# EAGLE schematic SAME54-Dev (EAGLE 9.3.0)

## Sheet 1 of 5: MCU
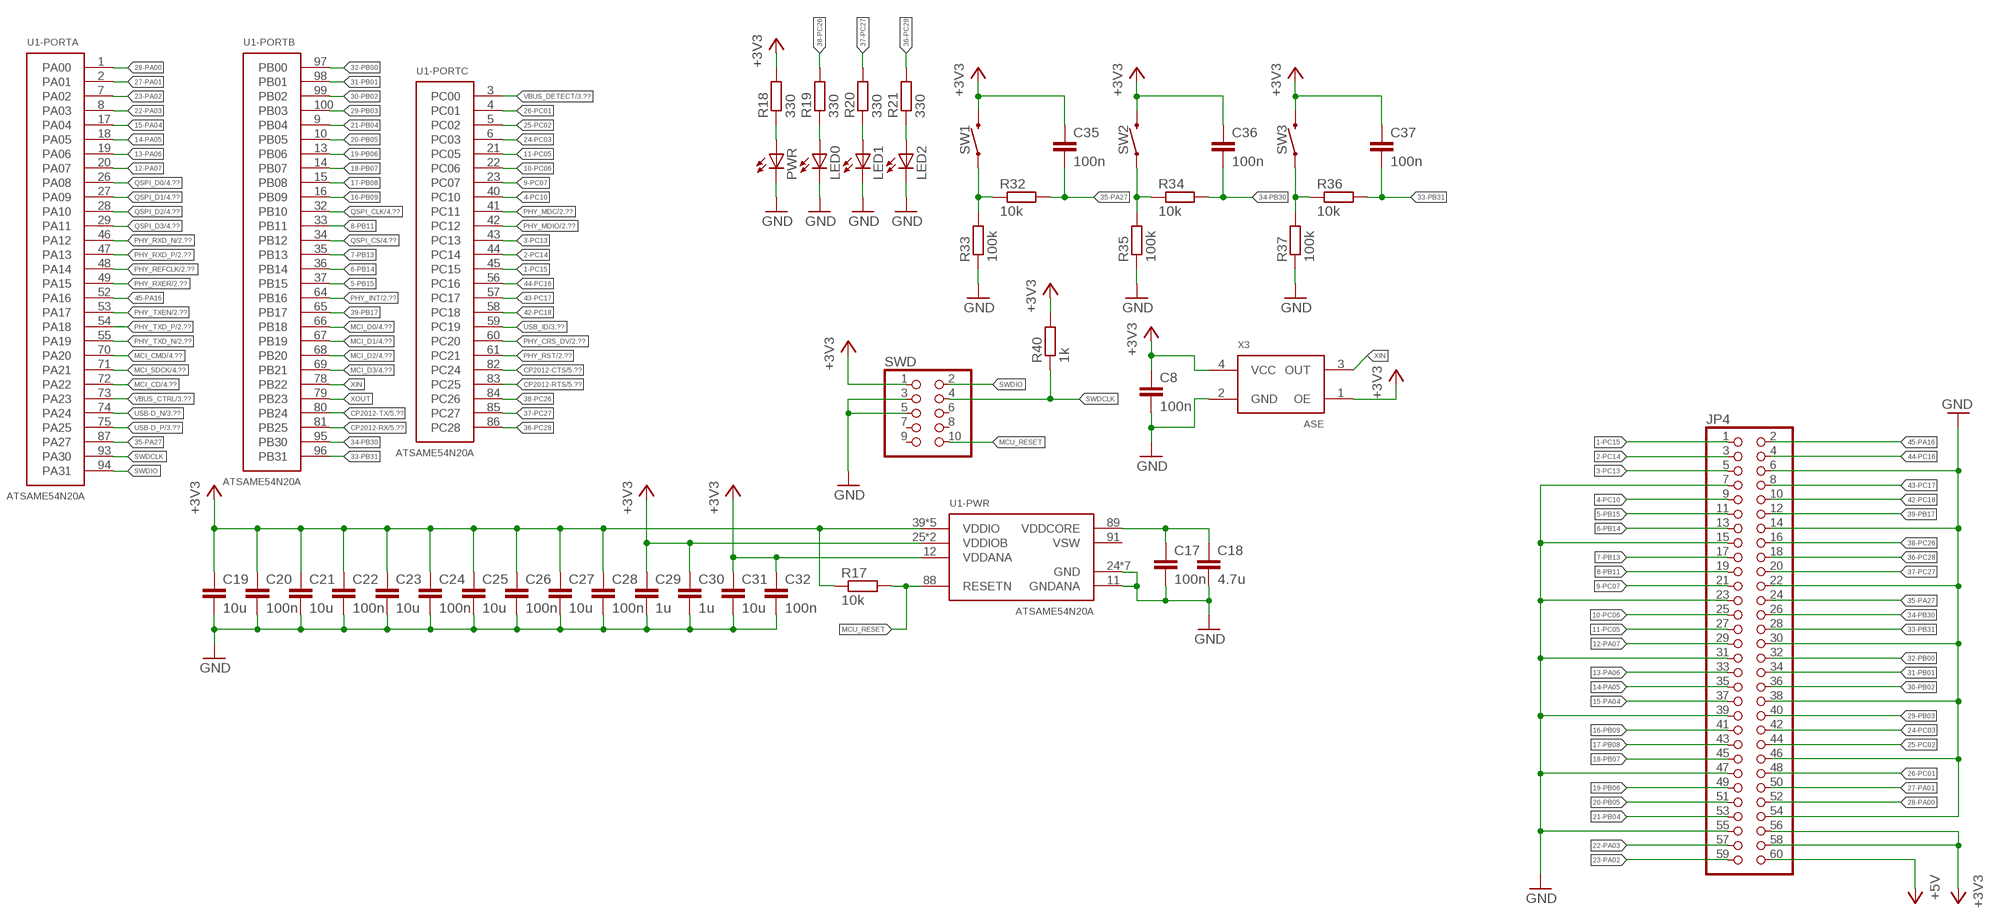
[diagram p0: schematic, sheet 1]

### Parts
C8  100n  C-EUC0603  [C0603]
C17  100n  C-EUC0603  [C0603]
C18  4.7u  C-EUC0805  [C0805]
C19  10u  C-EUC0805  [C0805]
C20  100n  C-EUC0603  [C0603]
C21  10u  C-EUC0805  [C0805]
C22  100n  C-EUC0603  [C0603]
C23  10u  C-EUC0805  [C0805]
C24  100n  C-EUC0603  [C0603]
C25  10u  C-EUC0805  [C0805]
C26  100n  C-EUC0603  [C0603]
C27  10u  C-EUC0805  [C0805]
C28  100n  C-EUC0603  [C0603]
C29  1u  C-EUC0805  [C0805]
C30  1u  C-EUC0805  [C0805]
C31  10u  C-EUC0805  [C0805]
C32  100n  C-EUC0603  [C0603]
C35  100n  C-EUC0603  [C0603]
C36  100n  C-EUC0603  [C0603]
C37  100n  C-EUC0603  [C0603]
JP4  PINHD-2X30  [2X30]
LED0  LEDCHIPLED_0603  [CHIPLED_0603]
LED1  LEDCHIPLED_0603  [CHIPLED_0603]
LED2  LEDCHIPLED_0603  [CHIPLED_0603]
PWR  LEDCHIPLED_0603  [CHIPLED_0603]
R17  10k  R-EU_R0603  [R0603]
R18  330  R-EU_R0603  [R0603]
R19  330  R-EU_R0603  [R0603]
R20  330  R-EU_R0603  [R0603]
R21  330  R-EU_R0603  [R0603]
R32  10k  R-EU_R0603  [R0603]
R33  100k  R-EU_R0603  [R0603]
R34  10k  R-EU_R0603  [R0603]
R35  100k  R-EU_R0603  [R0603]
R36  10k  R-EU_R0603  [R0603]
R37  100k  R-EU_R0603  [R0603]
R40  1k  R-EU_R0603  [R0603]
SW1  MOMENTARY-SWITCH-SPST-SMD-6.2MM-TALL  [TACTILE_SWITCH_SMD_6.2MM_TALL]
SW2  MOMENTARY-SWITCH-SPST-SMD-6.2MM-TALL  [TACTILE_SWITCH_SMD_6.2MM_TALL]
SW3  MOMENTARY-SWITCH-SPST-SMD-6.2MM-TALL  [TACTILE_SWITCH_SMD_6.2MM_TALL]
SWD  PINHD-2X5  [2X05]
U1  ATSAME54N20A  [TQFP100]
X3  ASE  [ASE]

### Nets
1-PC15: JP4.1 U1.45(-PORTC:PC15)
2-PC14: JP4.3 U1.44(-PORTC:PC14)
3-PC13: JP4.5 U1.43(-PORTC:PC13)
4-PC10: JP4.9 U1.40(-PORTC:PC10)
5-PB15: JP4.11 U1.37(-PORTB:PB15)
6-PB14: JP4.13 U1.36(-PORTB:PB14)
7-PB13: JP4.17 U1.35(-PORTB:PB13)
8-PB11: JP4.19 U1.33(-PORTB:PB11)
9-PC07: JP4.21 U1.23(-PORTC:PC07)
10-PC06: JP4.25 U1.22(-PORTC:PC06)
11-PC05: JP4.27 U1.21(-PORTC:PC05)
12-PA07: JP4.29 U1.20(-PORTA:PA07)
13-PA06: JP4.33 U1.19(-PORTA:PA06)
14-PA05: JP4.35 U1.18(-PORTA:PA05)
15-PA04: JP4.37 U1.17(-PORTA:PA04)
16-PB09: JP4.41 U1.16(-PORTB:PB09)
17-PB08: JP4.43 U1.15(-PORTB:PB08)
18-PB07: JP4.45 U1.14(-PORTB:PB07)
19-PB06: JP4.49 U1.13(-PORTB:PB06)
20-PB05: JP4.51 U1.10(-PORTB:PB05)
21-PB04: JP4.53 U1.9(-PORTB:PB04)
22-PA03: JP4.57 U1.8(-PORTA:PA03)
23-PA02: JP4.59 U1.7(-PORTA:PA02)
24-PC03: JP4.42 U1.6(-PORTC:PC03)
25-PC02: JP4.44 U1.5(-PORTC:PC02)
26-PC01: JP4.48 U1.4(-PORTC:PC01)
27-PA01: JP4.50 U1.2(-PORTA:PA01)
28-PA00: JP4.52 U1.1(-PORTA:PA00)
29-PB03: JP4.40 U1.100(-PORTB:PB03)
30-PB02: JP4.36 U1.99(-PORTB:PB02)
31-PB01: JP4.34 U1.98(-PORTB:PB01)
32-PB00: JP4.32 U1.97(-PORTB:PB00)
33-PB31: C37.2 JP4.28 R36.2 U1.96(-PORTB:PB31)
34-PB30: C36.2 JP4.26 R34.2 U1.95(-PORTB:PB30)
35-PA27: C35.2 JP4.24 R32.2 U1.87(-PORTA:PA27)
36-PC28: JP4.18 R21.2 U1.86(-PORTC:PC28)
37-PC27: JP4.20 R20.2 U1.85(-PORTC:PC27)
38-PC26: JP4.16 R19.2 U1.84(-PORTC:PC26)
39-PB17: JP4.12 U1.65(-PORTB:PB17)
42-PC18: JP4.10 U1.58(-PORTC:PC18)
43-PC17: JP4.8 U1.57(-PORTC:PC17)
44-PC16: JP4.4 U1.56(-PORTC:PC16)
45-PA16: JP4.2 U1.52(-PORTA:PA16)
+3V3: C8.1 C19.1 C20.1 C21.1 C22.1 C23.1 C24.1 C25.1 C26.1 C27.1 C28.1 C29.1 C30.1 C31.1 C32.1 C35.1 C36.1 C37.1 JP4.56 JP4.58 R17.1 R18.2 R40.2 SW1.B2 SW2.B2 SW3.B2 SWD.1 U1.12(-PWR:VDDANA) U1.25(-PWR:VDDIOB) U1.30(-PWR:VDDIOB) U1.39(-PWR:VDDIO) U1.51(-PWR:VDDIO) U1.63(-PWR:VDDIO) U1.77(-PWR:VDDIO) U1.92(-PWR:VDDIO) X3.1(OE) X3.4(VCC) ; also sheet 2,4,5
+5V: JP4.60 ; also sheet 3,5
CP2012-CTS: U1.82(-PORTC:PC24) ; also sheet 5
CP2012-RTS: U1.83(-PORTC:PC25) ; also sheet 5
CP2012-RX: U1.81(-PORTB:PB25) ; also sheet 5
CP2012-TX: U1.80(-PORTB:PB24) ; also sheet 5
GND: C8.2 C17.2 C18.2 C19.2 C20.2 C21.2 C22.2 C23.2 C24.2 C25.2 C26.2 C27.2 C28.2 C29.2 C30.2 C31.2 C32.2 JP4.6 JP4.7 JP4.14 JP4.15 JP4.22 JP4.23 JP4.30 JP4.31 JP4.38 JP4.39 JP4.46 JP4.47 JP4.54 JP4.55 LED0.C LED1.C LED2.C PWR.C R33.1 R35.1 R37.1 SWD.3 SWD.5 U1.11(-PWR:GNDANA) U1.24(-PWR:GND) U1.31(-PWR:GND) U1.38(-PWR:GND) U1.50(-PWR:GND) U1.62(-PWR:GND) U1.76(-PWR:GND) U1.90(-PWR:GND) X3.2(GND) ; also sheet 2,3,4,5
MCI_CD: U1.72(-PORTA:PA22) ; also sheet 4
MCI_CMD: U1.70(-PORTA:PA20) ; also sheet 4
MCI_D0: U1.66(-PORTB:PB18) ; also sheet 4
MCI_D1: U1.67(-PORTB:PB19) ; also sheet 4
MCI_D2: U1.68(-PORTB:PB20) ; also sheet 4
MCI_D3: U1.69(-PORTB:PB21) ; also sheet 4
MCI_SDCK: U1.71(-PORTA:PA21) ; also sheet 4
MCU_RESET: R17.2 SWD.10 U1.88(-PWR:RESETN)
N$9: PWR.A R18.1
N$14: LED0.A R19.1
N$17: C17.1 C18.1 U1.89(-PWR:VDDCORE)
N$18: LED1.A R20.1
N$19: LED2.A R21.1
N$21: R32.1 R33.2 SW1.A2
N$22: R34.1 R35.2 SW2.A2
N$23: R36.1 R37.2 SW3.A2
PHY_CRS_DV: U1.60(-PORTC:PC20) ; also sheet 2
PHY_INT: U1.64(-PORTB:PB16) ; also sheet 2
PHY_MDC: U1.41(-PORTC:PC11) ; also sheet 2
PHY_MDIO: U1.42(-PORTC:PC12) ; also sheet 2
PHY_REFCLK: U1.48(-PORTA:PA14) ; also sheet 2
PHY_RST: U1.61(-PORTC:PC21) ; also sheet 2
PHY_RXD_N: U1.46(-PORTA:PA12) ; also sheet 2
PHY_RXD_P: U1.47(-PORTA:PA13) ; also sheet 2
PHY_RXER: U1.49(-PORTA:PA15) ; also sheet 2
PHY_TXD_N: U1.55(-PORTA:PA19) ; also sheet 2
PHY_TXD_P: U1.54(-PORTA:PA18) ; also sheet 2
PHY_TXEN: U1.53(-PORTA:PA17) ; also sheet 2
QSPI_CLK: U1.32(-PORTB:PB10) ; also sheet 4
QSPI_CS: U1.34(-PORTB:PB12) ; also sheet 4
QSPI_D0: U1.26(-PORTA:PA08) ; also sheet 4
QSPI_D1: U1.27(-PORTA:PA09) ; also sheet 4
QSPI_D2: U1.28(-PORTA:PA10) ; also sheet 4
QSPI_D3: U1.29(-PORTA:PA11) ; also sheet 4
SWDCLK: R40.1 SWD.4 U1.93(-PORTA:PA30)
SWDIO: SWD.2 U1.94(-PORTA:PA31)
USB-D_N: U1.74(-PORTA:PA24) ; also sheet 3
USB-D_P: U1.75(-PORTA:PA25) ; also sheet 3
USB_ID: U1.59(-PORTC:PC19) ; also sheet 3
VBUS_CTRL: U1.73(-PORTA:PA23) ; also sheet 3
VBUS_DETECT: U1.3(-PORTC:PC00) ; also sheet 3
XIN: U1.78(-PORTB:PB22) X3.3(OUT)
XOUT: U1.79(-PORTB:PB23)
Unconnected: SWD.6 SWD.7 SWD.8 SWD.9 U1.91(-PWR:VSW)

## Sheet 2 of 5: Ethernet
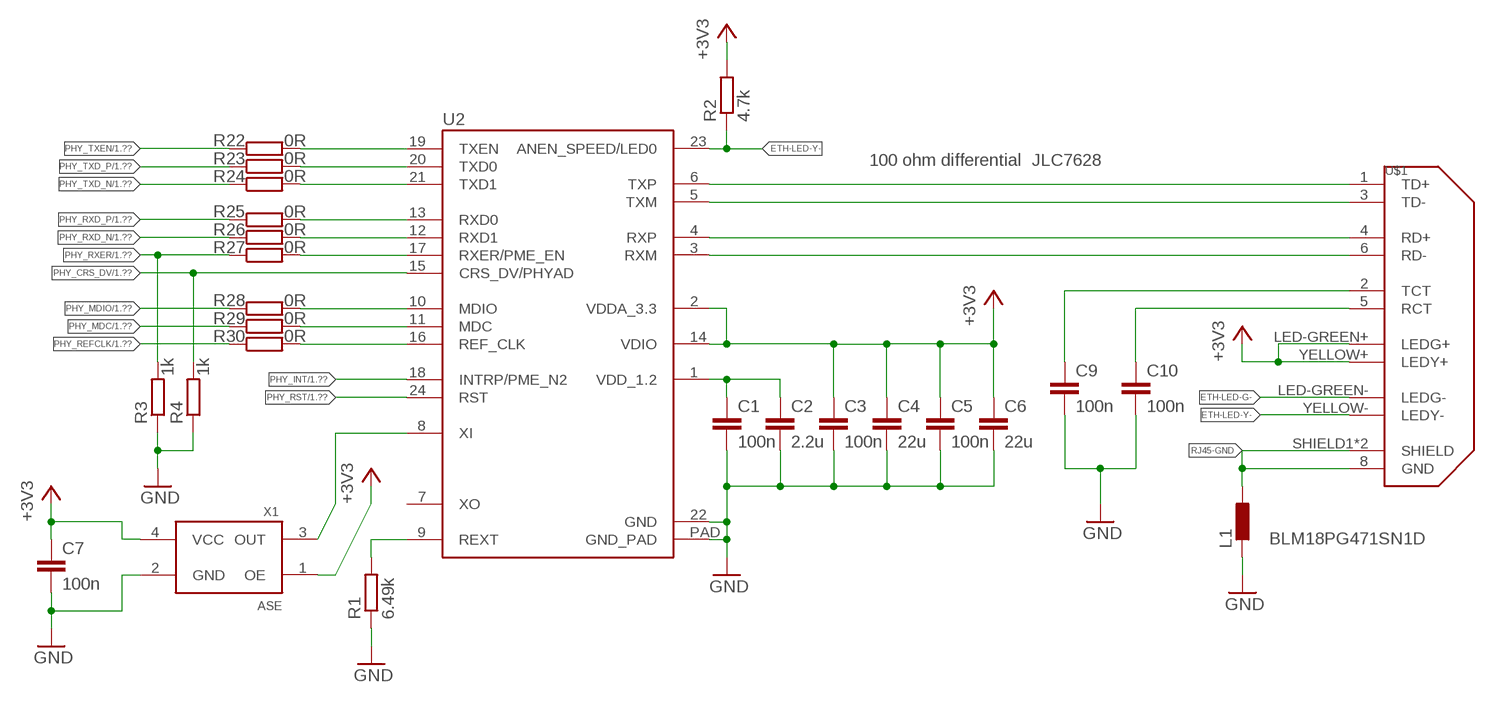
[diagram p1: schematic, sheet 2]

### Parts
C1  100n  C-EUC0603  [C0603]
C2  2.2u  C-EUC0805  [C0805]
C3  100n  C-EUC0603  [C0603]
C4  22u  C-EUC0805  [C0805]
C5  100n  C-EUC0603  [C0603]
C6  22u  C-EUC0805  [C0805]
C7  100n  C-EUC0603  [C0603]
C9  100n  C-EUC0603  [C0603]
C10  100n  C-EUC0603  [C0603]
L1  BLM18PG471SN1D  R-EU_R0603  [R0603]
R1  6.49k  R-EU_R0603  [R0603]
R2  4.7k  R-EU_R0603  [R0603]
R3  1k  R-EU_R0603  [R0603]
R4  1k  R-EU_R0603  [R0603]
R22  0R  R-EU_R0603  [R0603]
R23  0R  R-EU_R0603  [R0603]
R24  0R  R-EU_R0603  [R0603]
R25  0R  R-EU_R0603  [R0603]
R26  0R  R-EU_R0603  [R0603]
R27  0R  R-EU_R0603  [R0603]
R28  0R  R-EU_R0603  [R0603]
R29  0R  R-EU_R0603  [R0603]
R30  0R  R-EU_R0603  [R0603]
U2  KSZ8091RNA  [QFN24]
U$1  SI-50170-F  [SI-50170-F]
X1  ASE  [ASE]

### Nets
+3V3: C3.1 C4.1 C5.1 C6.1 C7.1 R2.2 U2.2(VDDA_3.3) U2.14(VDIO) U$1.LED-GREEN+(LEDG+) U$1.YELLOW+(LEDY+) X1.1(OE) X1.4(VCC) ; also sheet 1,4,5
ETH-LED-G-: U$1.LED-GREEN-(LEDG-)
ETH-LED-Y-: R2.1 U2.23(ANEN_SPEED/LED0) U$1.YELLOW-(LEDY-)
GND: C1.2 C2.2 C3.2 C4.2 C5.2 C6.2 C7.2 C9.2 C10.2 L1.1 R1.1 R3.1 R4.1 U2.22(GND) U2.PAD(GND_PAD) X1.2(GND) ; also sheet 1,3,4,5
N$1: U2.8(XI) X1.3(OUT)
N$6: C9.1 U$1.2(TCT)
N$7: C10.1 U$1.5(RCT)
N$13: R1.2 U2.9(REXT)
N$16: C1.1 C2.1 U2.1(VDD_1.2)
PHY_CRS_DV: R4.2 U2.15(CRS_DV/PHYAD) ; also sheet 1
PHY_INT: U2.18(INTRP/PME_N2) ; also sheet 1
PHY_MDC: R29.1 ; also sheet 1
PHY_MDIO: R28.1 ; also sheet 1
PHY_PIN_MDC: R29.2 U2.11(MDC)
PHY_PIN_MDIO: R28.2 U2.10(MDIO)
PHY_PIN_REFCLK: R30.2 U2.16(REF_CLK)
PHY_PIN_RXD_N: R26.2 U2.12(RXD1)
PHY_PIN_RXD_P: R25.2 U2.13(RXD0)
PHY_PIN_RXER: R27.2 U2.17(RXER/PME_EN)
PHY_PIN_TXD_N: R24.2 U2.21(TXD1)
PHY_PIN_TXD_P: R23.2 U2.20(TXD0)
PHY_PIN_TXEN: R22.2 U2.19(TXEN)
PHY_REFCLK: R30.1 ; also sheet 1
PHY_RST: U2.24(RST) ; also sheet 1
PHY_RXD_N: R26.1 ; also sheet 1
PHY_RXD_P: R25.1 ; also sheet 1
PHY_RXER: R3.2 R27.1 ; also sheet 1
PHY_TXD_N: R24.1 ; also sheet 1
PHY_TXD_P: R23.1 ; also sheet 1
PHY_TXEN: R22.1 ; also sheet 1
RJ45-GND: L1.2 U$1.8(GND) U$1.SHIELD1(SHIELD) U$1.SHIELD2(SHIELD)
RX_N: U2.3(RXM) U$1.6(RD-)
RX_P: U2.4(RXP) U$1.4(RD+)
TX_N: U2.5(TXM) U$1.3(TD-)
TX_P: U2.6(TXP) U$1.1(TD+)
Unconnected: U2.7(XO)

### Notes on the sheet
- 100 ohm differential  JLC7628

## Sheet 3 of 5: USB
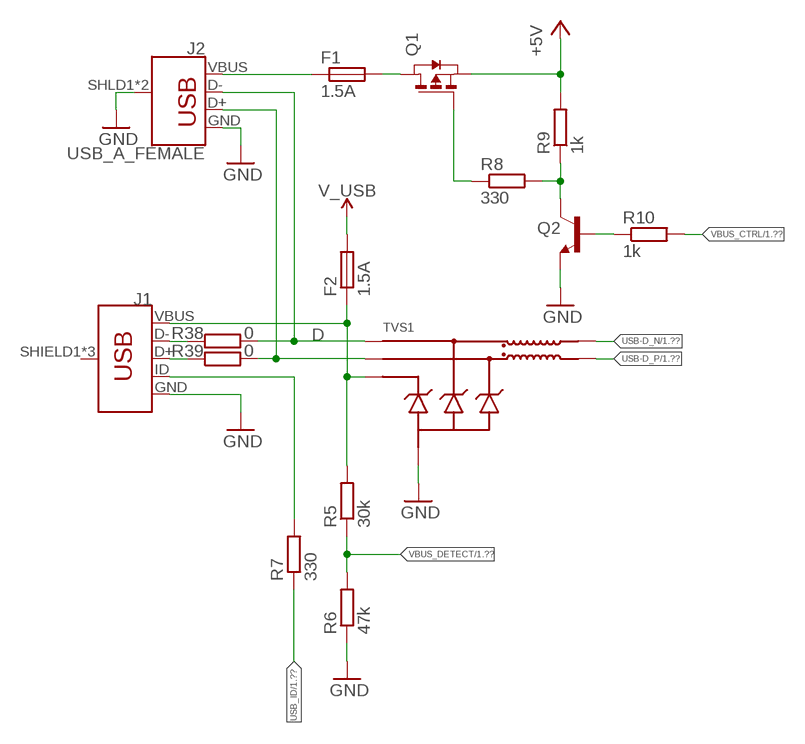
[diagram p2: schematic, sheet 3]

### Parts
F1  1.5A  R-EU_M1206  [M1206]
F2  1.5A  R-EU_M1206  [M1206]
J1  USB_MICRO-BREDUCED_PASTE  [USB-B-MICRO-SMD_RED_PASTE]
J2  USB_A_FEMALE  USB_A_SMT_FEMALE  [USB-A-S-SILK-FEMALE]
Q1  PMOSSOT23  [SOT-23]
Q2  TRANS_NPN-MMBTA42  [SOT23-3]
R5  30k  R-EU_R0603  [R0603]
R6  47k  R-EU_R0603  [R0603]
R7  330  R-EU_R0603  [R0603]
R8  330  R-EU_R0603  [R0603]
R9  1k  R-EU_R0603  [R0603]
R10  1k  R-EU_R0603  [R0603]
R38  0  R-EU_R0603  [R0603]
R39  0  R-EU_R0603  [R0603]
TVS1  EMI2121MT  [WDFN8]

### Nets
+5V: Q1.2(S) R9.2 ; also sheet 1,5
D: J2.D- R38.2 TVS1.1
D_P: J2.D+ R39.2 TVS1.2
GND: J1.GND J2.GND J2.SHLD1(SHIELD) J2.SHLD2(SHIELD) Q2.2(E) R6.1 TVS1.3(3,4,5) TVS1.4(3,4,5) TVS1.5(3,4,5) TVS1.PAD(3,4,5) ; also sheet 1,2,4,5
N$2: F1.1 J2.VBUS
N$3: F1.2 Q1.1(D)
N$4: F2.1 J1.VBUS R5.2 TVS1.6
N$11: Q1.3(G) R8.1
N$12: Q2.3(C) R8.2 R9.1
N$15: Q2.1(B) R10.1
USB-D_N: TVS1.8 ; also sheet 1
USB-D_P: TVS1.7 ; also sheet 1
USB_DEV_N: J1.D- R38.1
USB_DEV_P: J1.D+ R39.1
USB_ID: R7.1 ; also sheet 1
V_USB: F2.2 ; also sheet 5
VBUS_CTRL: R10.2 ; also sheet 1
VBUS_DETECT: R5.1 R6.2 ; also sheet 1
VBUS_HOST_EN: J1.ID R7.2
Unconnected: J1.SHIELD1(SHIELD) J1.SHIELD2(SHIELD) J1.SHIELD3(SHIELD)

## Sheet 4 of 5: Memory
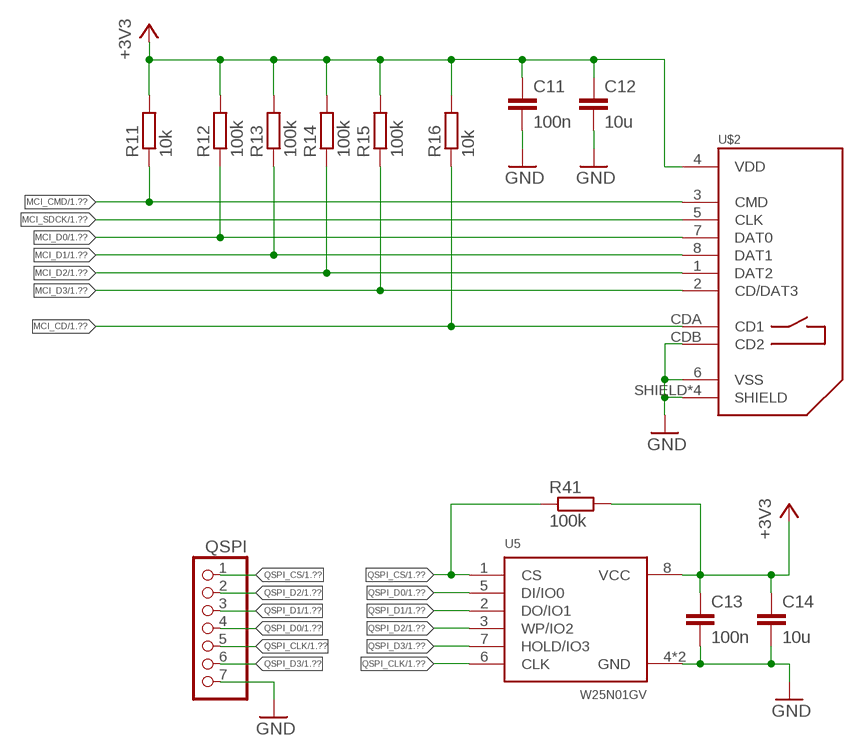
[diagram p3: schematic, sheet 4]

### Parts
C11  100n  C-EUC0603  [C0603]
C12  10u  C-EUC0805  [C0805]
C13  100n  C-EUC0603  [C0603]
C14  10u  C-EUC0805  [C0805]
QSPI  PINHD-1X7  [1X07]
R11  10k  R-EU_R0603  [R0603]
R12  100k  R-EU_R0603  [R0603]
R13  100k  R-EU_R0603  [R0603]
R14  100k  R-EU_R0603  [R0603]
R15  100k  R-EU_R0603  [R0603]
R16  10k  R-EU_R0603  [R0603]
R41  100k  R-EU_R0603  [R0603]
U5  W25N01GV  [WSON8]
U$2  DM3D-SF  [DM3D-SF]

### Nets
+3V3: C11.1 C12.1 C13.1 C14.1 R11.2 R12.2 R13.2 R14.2 R15.2 R16.2 R41.2 U5.8(VCC) U$2.4(VDD) ; also sheet 1,2,5
GND: C11.2 C12.2 C13.2 C14.2 QSPI.7 U5.4(GND) U5.PAD(GND) U$2.6(VSS) U$2.CDB(CD2) U$2.SHIELD U$2.SHIELD1(SHIELD) U$2.SHIELD2(SHIELD) U$2.SHIELD3(SHIELD) ; also sheet 1,2,3,5
MCI_CD: R16.1 U$2.CDA(CD1) ; also sheet 1
MCI_CMD: R11.1 U$2.3(CMD) ; also sheet 1
MCI_D0: R12.1 U$2.7(DAT0) ; also sheet 1
MCI_D1: R13.1 U$2.8(DAT1) ; also sheet 1
MCI_D2: R14.1 U$2.1(DAT2) ; also sheet 1
MCI_D3: R15.1 U$2.2(CD/DAT3) ; also sheet 1
MCI_SDCK: U$2.5(CLK) ; also sheet 1
QSPI_CLK: QSPI.5 U5.6(CLK) ; also sheet 1
QSPI_CS: QSPI.1 R41.1 U5.1(CS) ; also sheet 1
QSPI_D0: QSPI.4 U5.5(DI/IO0) ; also sheet 1
QSPI_D1: QSPI.3 U5.2(DO/IO1) ; also sheet 1
QSPI_D2: QSPI.2 U5.3(WP/IO2) ; also sheet 1
QSPI_D3: QSPI.6 U5.7(HOLD/IO3) ; also sheet 1

## Sheet 5 of 5: Power Supply
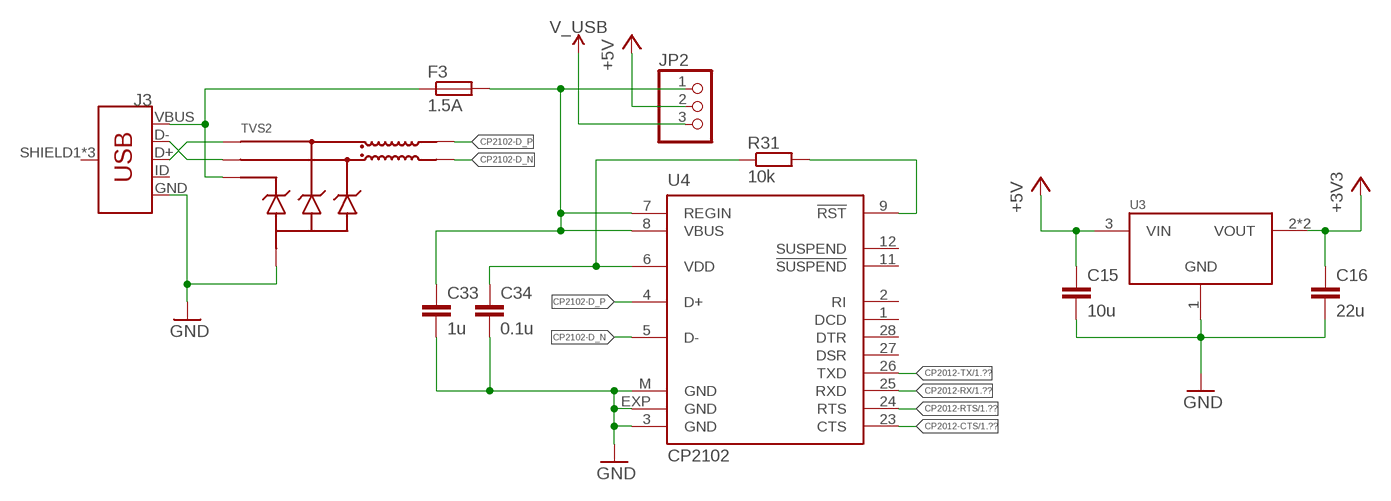
[diagram p4: schematic, sheet 5]

### Parts
C15  10u  C-EUC0805  [C0805]
C16  22u  C-EUC0805  [C0805]
C33  1u  C-EUC0805  [C0805]
C34  0.1u  C-EUC0603  [C0603]
F3  1.5A  R-EU_M1206  [M1206]
J3  USB_MICRO-BREDUCED_PASTE  [USB-B-MICRO-SMD_RED_PASTE]
JP2  PINHD-1X3  [1X03]
R31  10k  R-EU_R0603  [R0603]
TVS2  EMI2121MT  [WDFN8]
U3  AP1117  [SOT223]
U4  CP2102  [MLP28]

### Nets
+3V3: C16.1 U3.2(VOUT) U3.4(VOUT) ; also sheet 1,2,4
+5V: C15.1 JP2.2 U3.3(VIN) ; also sheet 1,3
CP2012-CTS: U4.23(CTS) ; also sheet 1
CP2012-RTS: U4.24(RTS) ; also sheet 1
CP2012-RX: U4.25(RXD) ; also sheet 1
CP2012-TX: U4.26(TXD) ; also sheet 1
CP2102-D_N: TVS2.7 U4.5(D-)
CP2102-D_P: TVS2.8 U4.4(D+)
GND: C15.2 C16.2 C33.2 C34.2 J3.GND TVS2.3(3,4,5) TVS2.4(3,4,5) TVS2.5(3,4,5) TVS2.PAD(3,4,5) U3.1(GND) U4.3(GND) U4.EXP(GND) U4.M(GND) ; also sheet 1,2,3,4
N$5: F3.1 J3.VBUS TVS2.6
N$8: C34.1 R31.1 U4.6(VDD)
N$10: C33.1 F3.2 JP2.1 U4.7(REGIN) U4.8(VBUS)
N$20: R31.2 U4.9(!RST)
PRE-TVS-D_N: J3.D- TVS2.2
PRE-TVS-D_P: J3.D+ TVS2.1
V_USB: JP2.3 ; also sheet 3
Unconnected: J3.ID J3.SHIELD1(SHIELD) J3.SHIELD2(SHIELD) J3.SHIELD3(SHIELD) U4.1(DCD) U4.2(RI) U4.11(!SUSPEND) U4.12(SUSPEND) U4.27(DSR) U4.28(DTR)

## Library data of the parts
C1-C37 = resistor:C-EU: CAPACITOR, European symbol
F1-F3 L1 R1-R41 = resistor:R-EU_: RESISTOR, European symbol
J1 J3 = SparkFun-Connectors:USB_MICRO-B: USB Type Micro-B Connector Male/female and PTH/SMT variants SparkFun Products: SparkFun microB USB Breakout <https://www.sparkfun.com/products/12035> SparkFun USB microB Plug Breakout <https://www.sparkfun.com/products/10031> SparkFun ESP8266 Thing <https://www.sparkfun.com/products/13231>; PROD_ID: CONN-11752
J2 = SparkFun-Connectors:USB_A: USB-A Connector Male and female variants, as well as PTH and SMT variants SparkFun Products: SparkFun XBee Explorer Dongle <https://www.sparkfun.com/products/11697> PTH Male SparkFun MicroView-USB Programmer <https://www.sparkfun.com/products/12924> SMT Male SparkFun USB Type A Female Breakout <https://www.sparkfun.com/products/12700> SMT Female; PROD_ID: CONN-09520; SF_ID: PRT-09011
JP2 = pinhead:PINHD-1X3: PIN HEADER
JP4 = pinhead:PINHD-2X30: PIN HEADER
LED0 LED1 LED2 PWR = adafruit:LED: LED OSRAM: - CHIPLED LG R971, LG N971, LY N971, LG Q971, LY Q971, LO R971, LY R971 LH N974, LH R974 LS Q976, LO Q976, LY Q976 LO Q996 - Hyper CHIPLED LW Q18S LB Q993, LB Q99A, LB R99A - SideLED LS A670, LO A670, LY A670, LG A670, LP A670 LB A673, LV A673, LT A673, LW A673 LH A674 LY A675 LS A676, LA A676, LO A676, LY A676, LW A676 LS A679, LY A679, LG A679 - Hyper Micro SIDELED® LS Y876, LA Y876, LO Y876, LY Y876 LT Y87S - SmartLED LW L88C, LW L88S LB L89C, LB L89S, LG L890 LS L89K, LO L89K, LY L89K LS L896, LA L896, LO L896, LY L896 - TOPLED LS T670, LO T670, LY T670, LG T670, LP T670 LSG T670, LSP T670, LSY T670, LOP T670, LYG T670 LG T671, LOG T671, LSG T671 LB T673, LV T673, LT T673, LW T673 LH T674 LS T676, LA T676, LO T676, LY T676, LB T676, LH T676, LSB T676, LW T676 LB T67C, LV T67C, LT T67C, LS T67K, LO T67K, LY T67K, LW E67C LS E67B, LA E67B, LO E67B, LY E67B, LB E67C, LV E67C, LT E67C LW T67C LS T679, LY T679, LG T679 LS T770, LO T770, LY T770, LG T770, LP T770 LB T773, LV T773, LT T773, LW T773 LH T774 LS E675, LA E675, LY E675, LS T675 LS T776, LA T776, LO T776, LY T776, LB T776 LHGB T686 LT T68C, LB T68C - Hyper Mini TOPLED® LB M676 - Mini TOPLED Santana® LG M470 LS M47K, LO M47K, LY M47K Source: http://www.osram.convergy.de/
Q1 = zetex:PMOSSOT23: MOS FET; OC_FARNELL: unknown; OC_NEWARK: unknown
Q2 = SparkFun-DiscreteSemi:TRANS_NPN: NPN transistor Current controlled devices typically used to amplify current or used as a switch. BC547 - COM-08928 <http://www.sparkfun.com/products/8928> (TO-92 45V 100mA) (1.Collector 2.Base 3.Emitter) 2N3904 - COM-00521 <http://www.sparkfun.com/products/521> (TO-92 40V 200mA) (1.Emitter 2.Base 3.Collector) P2N2222A - COM-12852 <http://www.sparkfun.com/products/12852> (TO-92 40V 600mA) (1.Collector 2.Base 3.Emitter); PROD_ID: TRANS-09116; VALUE: 500mA/300V
QSPI = pinhead:PINHD-1X7: PIN HEADER
SW1-SW3 = SparkFun-Switches:MOMENTARY-SWITCH-SPST: Momentary Switch (Pushbutton) - SPST Normally-open (NO) SPST momentary switches (buttons, pushbuttons). Variants PTH-12MM - 12mm square, through-hole Momentary Pushbutton Switch - 12mm Square <https://www.sparkfun.com/products/9190> (COM-09190) PTH-6.0MM, PTH-6.0MM-KIT - 6.0mm square, through-hole Mini Pushbutton Switch <https://www.sparkfun.com/products/97> (COM-00097) KIT package intended for soldering kit's - only one side of pads' copper is exposed. PTH-RIGHT-ANGLE-KIT - Right-angle, through-hole Right Angle Tactile Button <https://www.sparkfun.com/products/10791> - Used on SparkFun BigTime Watch Kit <https://www.sparkfun.com/products/11734> SMD-12MM - 12mm square, surface-mount Tactile Button - SMD (12mm) <https://www.sparkfun.com/products/12993> (COM-12993) Used on SparkFun PicoBoard <https://www.sparkfun.com/products/11888> SMD-4.5MM - 4.5mm Square Trackball Switch Used on SparkFun Blackberry Trackballer Breakout <https://www.sparkfun.com/products/13169> SMD-4.6MMX2.8MM - 4.60mm x 2.80mm, surface mount Used on SparkFun SAMD21 Mini Breakout <https://www.sparkfun.com/products/13664> SMD-5.2MM, SMD-5.2-REDUNDANT - 5.2mm square, surface-mount Mini Pushbutton Switch - SMD <https://www.sparkfun.com/products/8720> (COM-08720) Used on Arduino Pro Mini <https://www.sparkfun.com/products/11114> REDUNDANT package connects both switch circuits together SMD-6.0X3.5MM - 6.0 x 3.5mm, surface mount Momentary Reset Switch SMD <https://www.sparkfun.com/products/8229> (COM-08229) SMD-6.2MM-TALL - 6.2mm square, surface mount Tactile Button - SMD (6mm) <https://www.sparkfun.com/products/12992> Used on SparkFun Digital Sandbox <https://www.sparkfun.com/products/12651> SMD-RIGHT-ANGLE - Right-angle, surface mount Used on SparkFun Block for Intel® Edison - Arduino <https://www.sparkfun.com/products/13036>; PROD_ID: SWCH-11966; SF_SKU: COM-12992
SWD = pinhead:PINHD-2X5: PIN HEADER
TVS1 TVS2 = discrete-custom:EMI2121MT
U1 = micro-custom:ATSAME54N20A
U2 = ic-custom:KSZ8091RNA: PHY
U3 = power-custom:AP1117
U4 = silabs:CP210*: Single-Chip USB to UART Bridge Source: www.silabs.com .. CP2101.pdf / cp2102.pdf; MF: FARNELL; MPN: CP2102-GM; OC_FARNELL: 9282130; OC_NEWARK: 30K5635
U5 = ic-custom:W25N01GV
U$1 = conn-custom:SI-50170-F
U$2 = conn-custom:DM3D-SF
X1 X3 = crystal-custom:ASE

## Net classes
0 default: width 0.2 mm, drill 0.3 mm, clearance 0.191 mm